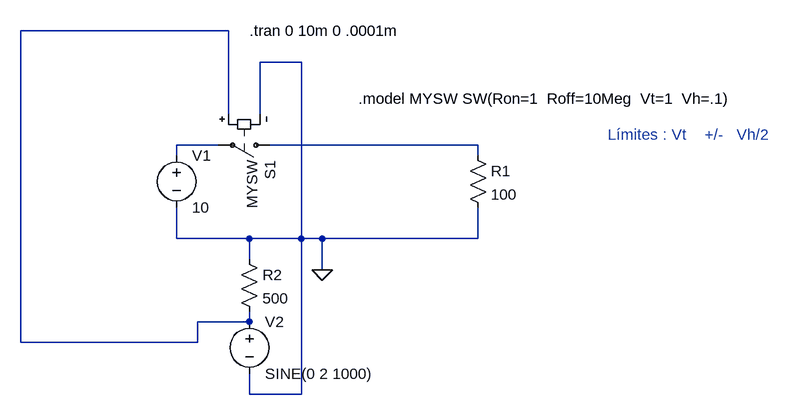
[diagram p0: schematic llave.asc]
llave.asc, the LTspice schematic file:
Version 4
SHEET 1 1144 680
WIRE 48 -48 -272 -48
WIRE 160 0 96 0
WIRE 48 80 48 -48
WIRE 96 80 96 0
WIRE 32 128 -32 128
WIRE 432 128 112 128
WIRE -32 144 -32 128
WIRE 432 144 432 128
WIRE -32 272 -32 224
WIRE 80 272 -32 272
WIRE 160 272 160 0
WIRE 160 272 80 272
WIRE 192 272 160 272
WIRE 432 272 432 224
WIRE 432 272 192 272
WIRE 80 304 80 272
WIRE 192 320 192 272
WIRE 80 400 80 384
WIRE 80 400 0 400
WIRE -272 432 -272 -48
WIRE 0 432 0 400
WIRE 0 432 -272 432
WIRE 80 512 80 480
WIRE 160 512 160 272
WIRE 160 512 80 512
FLAG 192 320 0
SYMBOL res 416 128 R0
SYMATTR InstName R1
SYMATTR Value 100
SYMBOL voltage -32 128 R0
WINDOW 123 0 0 Left 2
WINDOW 39 0 0 Left 2
SYMATTR InstName V1
SYMATTR Value 10
SYMBOL voltage 80 384 R0
WINDOW 123 0 0 Left 2
WINDOW 39 0 0 Left 2
SYMATTR InstName V2
SYMATTR Value SINE(0 2 1000)
SYMBOL res 64 288 R0
SYMATTR InstName R2
SYMATTR Value 500
SYMBOL sw 128 128 R90
WINDOW 3 24 44 Left 2
SYMATTR Value MYSW
SYMATTR InstName S1
SYMATTR SpiceLine 2
TEXT 80 -48 Left 2 !.tran 0 10m 0 .0001m
TEXT 248 56 Left 2 !.model MYSW SW(Ron=1  Roff=10Meg  Vt=1  Vh=.1)
TEXT 632 112 Left 2 ;Límites : Vt    +/-   Vh/2

The netlist it stands for:
* llave.asc
R1 N003 0 100
V1 N002 0 10
V2 N001 0 SINE(0 2 1000)
R2 0 N001 500
S1 N003 N002 N001 0 MYSW 2
.tran 0 10m 0 .0001m
.model MYSW SW(Ron=1  Roff=10Meg  Vt=1  Vh=.1)
* Límites : Vt    +/-   Vh/2
.backanno
.end